# Altium schematic sheet [03] - 28 PINS SCHEMATIC.SchDoc (part 2 of 3)
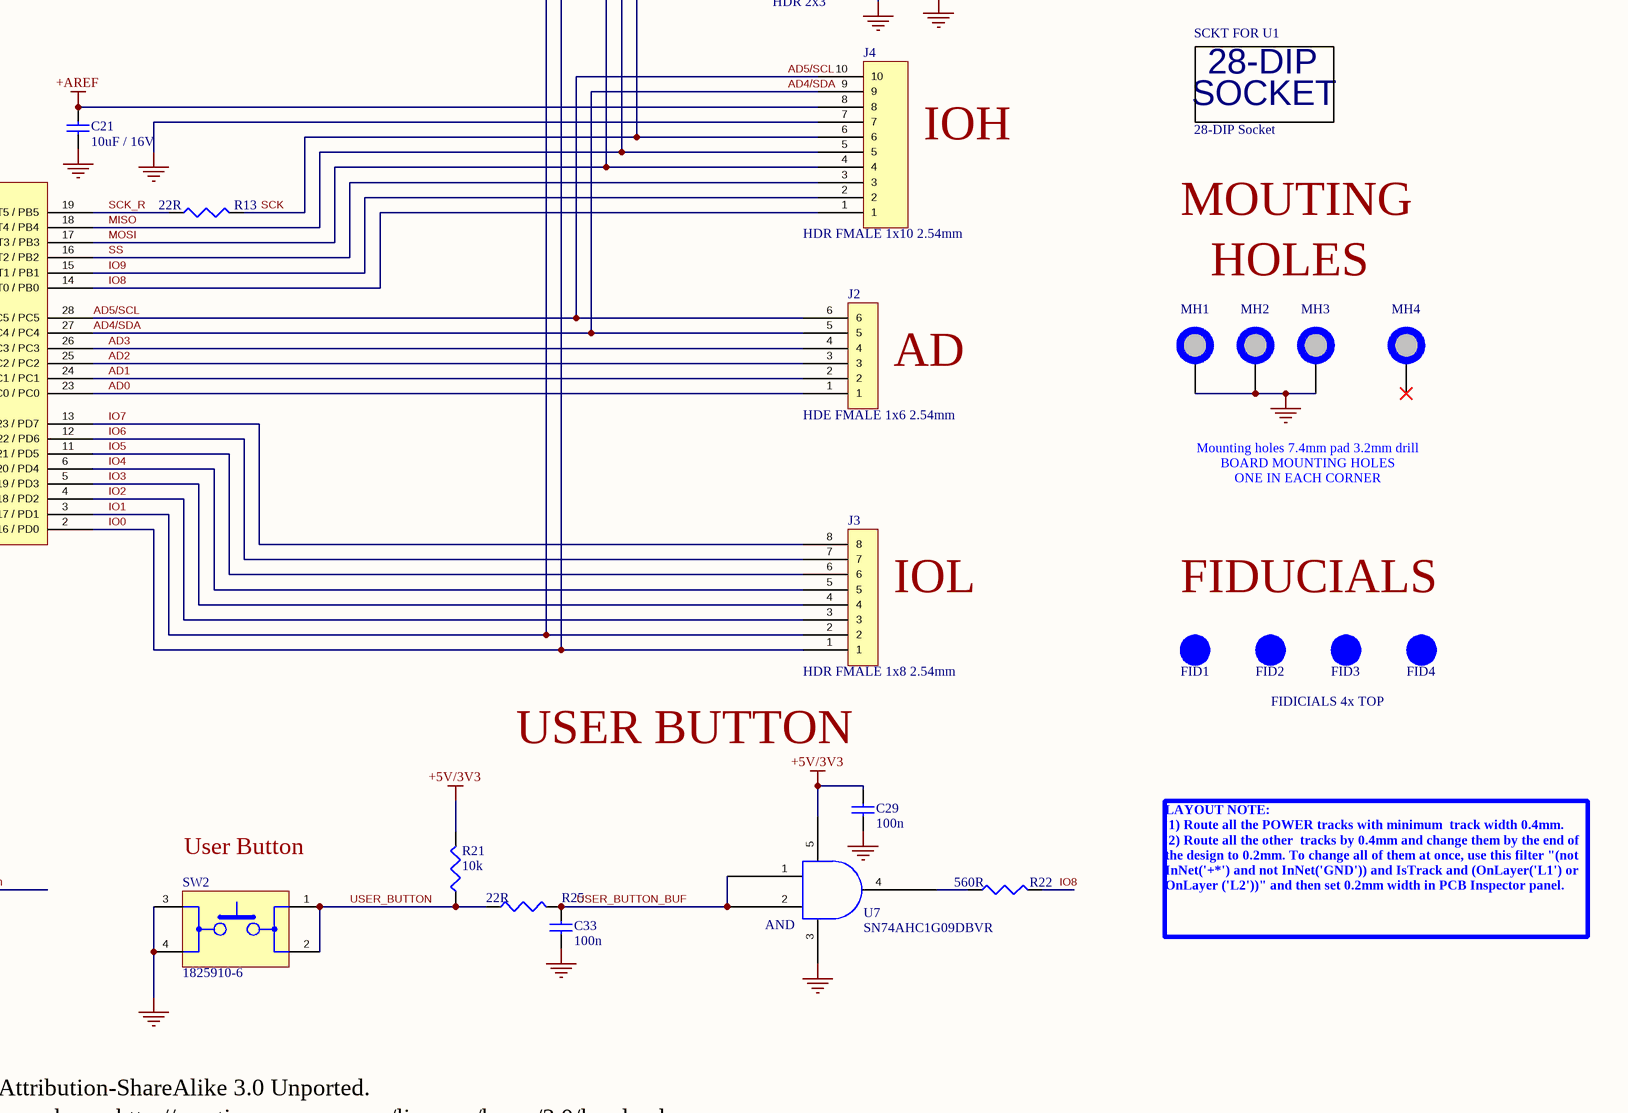
[diagram p4: [03] - 28 PINS SCHEMATIC.SchDoc, bottom right]
## Library data of the parts
C1 C2 = EEE-1AA101WR: Cap Aluminum Lytic 100uF 10V 20% (5 X 5.4mm) SMD 50mA 1000h 85C Automotive T/R; Manufacturer: Panasonic; Life (Hours): 1000Hour; Supplier 1: Digi-Key; Manufacturer Part Number: EEE-1AA101WR; Stock 1: 0; Pricing 1: 1=0.33, 10=0.232, 100=0.1395, 500=0.10462 (USD); Mount: Surface Mount,PCB; Case/Package: Radial; Contact Plating: Tin; Min Operating Temperature: -40°C; Max Operating Temperature: 85°C; Capacitance: 100uF; Tolerance: 20%; Ripple Current: 50mA; Voltage Rating: 10V; Packaging: Tape and Reel; Package Quantity: 1; Voltage Rating (DC): 10V; Termination: SMD/SMT; Ripple Current (AC): 50mA; Diameter: 5mm; Length: 5.5mm; Height: 5.4mm; Height - Seated (Max): 0.213inch; Radiation Hardening: No; Lead Free: Lead Free; REACH SVHC: Unknown; ComponentLink1URL: https://datasheet.ciiva.com/2983/aba0000ce2-2983906.pdf; ComponentLink1Description: https://datasheet.ciiva.com/2983/aba0000ce2-2983906.pdf; ComponentLink2URL: https://datasheet.ciiva.com/24027/aba0000ce2-40801-24027541.pdf; ComponentLink2Description: https://datasheet.ciiva.com/24027/aba0000ce2-40801-24027541.pdf; ComponentLink3URL: https://datasheet.ciiva.com/30075/11aba0000ce2-30075303.pdf; ComponentLink3Description: https://datasheet.ciiva.com/30075/11aba0000ce2-30075303.pdf; ComponentLink4URL: https://datasheet.ciiva.com/16427/aba0000ce2-16427544.pdf; ComponentLink4Description: https://datasheet.ciiva.com/16427/aba0000ce2-16427544.pdf; ComponentLink5URL: https://datasheet.ciiva.com/14598/70255710-14598233.pdf; ComponentLink5Description: https://datasheet.ciiva.com/14598/70255710-14598233.pdf; ComponentLink6URL: https://datasheet.ciiva.com/14605/70255710-14605689.pdf; ComponentLink6Description: https://datasheet.ciiva.com/14605/70255710-14605689.pdf; ComponentLink7URL: https://datasheet.ciiva.com/11673/aba0000ce2-11673882.pdf; ComponentLink7Description: https://datasheet.ciiva.com/11673/aba0000ce2-11673882.pdf; ComponentLink8URL: https://datasheet.ciiva.com/26945/getdatasheetpartid-169213-26945071.pdf; ComponentLink8Description: https://datasheet.ciiva.com/26945/getdatasheetpartid-169213-26945071.pdf; Supplier Part Number 1: PCE3867CT-ND
C3 C12 C13 C19 C21 C22 C34 = C2012X5R1C106M125AC: CAP CER 10UF 16V X5R 0805; Manufacturer: TDK; Dielectric Material: Ceramic; Tolerance: 20%; Supplier 1: Digi-Key; Manufacturer Part Number: C2012X5R1C106M125AC; Stock 1: 0; Pricing 1: 1=0.33, 10=0.272, 100=0.136, 250=0.102, 500=0.0901, 1000=0.0799 (USD); Mount: Surface Mount; Case/Package: 0805; Number of Pins: 2; Weight: 0.000194oz; Case Code (Metric): 2012; Case Code (Imperial): 0805; Min Operating Temperature: -55°C; Max Operating Temperature: 85°C; Capacitance: 10uF; Voltage Rating: 16V; Packaging: Tape and Reel; Voltage Rating (DC): 16V; Dielectric: X5R; Termination: SMD/SMT; Package Quantity: 1; Composition: Ceramic; Length: 2mm; Height: 1.25mm; Width: 0.049inch; Depth: 1.25mm; Thickness: 0.057inch; REACH SVHC: No SVHC; Lead Free: Lead Free; ComponentLink1URL: https://datasheet.ciiva.com/6289/tdkmlcccaprange-6289238.pdf; ComponentLink1Description: https://datasheet.ciiva.com/6289/tdkmlcccaprange-6289238.pdf; ComponentLink2URL: https://datasheet.ciiva.com/22725/1913358-22725558.pdf; ComponentLink2Description: https://datasheet.ciiva.com/22725/1913358-22725558.pdf; ComponentLink3URL: https://datasheet.ciiva.com/6252/tdkmlcccaprange-6252105.pdf; ComponentLink3Description: https://datasheet.ciiva.com/6252/tdkmlcccaprange-6252105.pdf; ComponentLink4URL: https://datasheet.ciiva.com/6252/tdkmlcccaprange-6252108.pdf; ComponentLink4Description: https://datasheet.ciiva.com/6252/tdkmlcccaprange-6252108.pdf; ComponentLink5URL: https://datasheet.ciiva.com/24218/c2012x5r1c106m125ac-264806-24218892.pdf; ComponentLink5Description: https://datasheet.ciiva.com/24218/c2012x5r1c106m125ac-264806-24218892.pdf; ComponentLink6URL: https://datasheet.ciiva.com/23803/1796654-23803022.pdf; ComponentLink6Description: https://datasheet.ciiva.com/23803/1796654-23803022.pdf; Supplier Part Number 1: 445-4115-1-ND
C4-C6 C8 C11 C14-C17 C20 C23 C24 C26 C28-C33 = C2012X7R1H104K085AA: CAP CER 0.1UF 50V X7R 0805; Manufacturer: TDK; Dielectric Material: Ceramic; Capacitance: 100nF; Tolerance: 10%; Supplier 1: Digi-Key; Manufacturer Part Number: C2012X7R1H104K085AA; Stock 1: 0; Pricing 1: 1=0.13, 10=0.093, 100=0.0438, 500=0.0307, 1000=0.02541 (USD); Mount: Surface Mount; Case/Package: 0805; Number of Pins: 2; Weight: 0.000194oz; Case Code (Metric): 2012; Case Code (Imperial): 0805; Min Operating Temperature: -55°C; Max Operating Temperature: 125°C; Dielectric: X7R; Voltage Rating: 50V; Packaging: Tape and Reel; Voltage Rating (DC): 50V; Termination: SMD/SMT; Package Quantity: 1; Composition: Ceramic; Voltage: 50V; Length: 2mm; Height: 0.85mm; Depth: 1.25mm; Width: 0.049inch; Thickness: 0.037inch; Radiation Hardening: No; REACH SVHC: No SVHC; Lead Free: Lead Free; ComponentLink1URL: https://datasheet.ciiva.com/11788/0900766b80c1bb00-11788128.pdf; ComponentLink1Description: https://datasheet.ciiva.com/11788/0900766b80c1bb00-11788128.pdf; ComponentLink2URL: https://datasheet.ciiva.com/6250/tdkmlcccaprange-6250821.pdf; ComponentLink2Description: https://datasheet.ciiva.com/6250/tdkmlcccaprange-6250821.pdf; ComponentLink3URL: https://datasheet.ciiva.com/24217/c2012x7r1h104k085aa-264864-24217862.pdf; ComponentLink3Description: https://datasheet.ciiva.com/24217/c2012x7r1h104k085aa-264864-24217862.pdf; ComponentLink4URL: https://datasheet.ciiva.com/24191/e412-c-24191447.pdf; ComponentLink4Description: https://datasheet.ciiva.com/24191/e412-c-24191447.pdf; ComponentLink5URL: https://datasheet.ciiva.com/6250/tdkmlcccaprange-6250824.pdf; ComponentLink5Description: https://datasheet.ciiva.com/6250/tdkmlcccaprange-6250824.pdf; ComponentLink6URL: https://datasheet.ciiva.com/23803/1796654-23803035.pdf; ComponentLink6Description: https://datasheet.ciiva.com/23803/1796654-23803035.pdf; ComponentLink7URL: https://datasheet.ciiva.com/28602/1571323-28602204.pdf; ComponentLink7Description: https://datasheet.ciiva.com/28602/1571323-28602204.pdf; Supplier Part Number 1: 445-7534-1-ND
C7 = C2012X5R1E105K125AA: CAP CER 1UF 25V X5R 0805; Manufacturer: TDK; Dielectric Material: Ceramic; Tolerance: 10%; Supplier 1: Digi-Key; Manufacturer Part Number: C2012X5R1E105K125AA; Stock 1: 20000; Pricing 1: 1=0.21, 10=0.146, 100=0.0688, 500=0.04822, 1000=0.03993 (USD); Mount: Surface Mount; Case/Package: 0805; Number of Pins: 2; Weight: 0.000194oz; Case Code (Metric): 2012; Case Code (Imperial): 0805; Min Operating Temperature: -55°C; Max Operating Temperature: 85°C; Capacitance: 1uF; Voltage Rating: 25V; Packaging: Tape and Reel; Voltage Rating (DC): 25V; Dielectric: X5R; Termination: SMD/SMT; Package Quantity: 2000; Composition: Ceramic; Voltage: 25V; Length: 2mm; Height: 1.25mm; Depth: 1.25mm; Width: 0.049inch; Thickness: 0.057inch; Radiation Hardening: No; Lead Free: Lead Free; REACH SVHC: No SVHC; ComponentLink1URL: https://datasheet.ciiva.com/11787/0900766b80c1bb00-11787608.pdf; ComponentLink1Description: https://datasheet.ciiva.com/11787/0900766b80c1bb00-11787608.pdf; ComponentLink2URL: https://datasheet.ciiva.com/24218/c2012x5r1e105k125aa-264807-24218920.pdf; ComponentLink2Description: https://datasheet.ciiva.com/24218/c2012x5r1e105k125aa-264807-24218920.pdf; ComponentLink3URL: https://datasheet.ciiva.com/16449/e412-c-16449595.pdf; ComponentLink3Description: https://datasheet.ciiva.com/16449/e412-c-16449595.pdf; ComponentLink4URL: https://datasheet.ciiva.com/28602/1744655-28602171.pdf; ComponentLink4Description: https://datasheet.ciiva.com/28602/1744655-28602171.pdf; ComponentLink5URL: https://datasheet.ciiva.com/15192/getdatasheetpartid-726707-15192140.pdf; ComponentLink5Description: https://datasheet.ciiva.com/15192/getdatasheetpartid-726707-15192140.pdf; Supplier Part Number 1: 445-1419-1-ND
C9 C10 C25 C27 = C0805C180J5GAC-TU: CAP CER 18PF 50V NP0 0805; Manufacturer: KEMET; Dielectric Material: Ceramic; Tolerance: 5%; Dielectric: C0G; Temperature Coefficient: 30ppm/°C; Dissipation Factor: 0.1%; Supplier 1: Digi-Key; Manufacturer Part Number: C0805C180J5GAC-TU; Stock 1: 25150; Pricing 1: 1=0.13, 10=0.09, 100=0.0425, 500=0.02982, 1000=0.02468 (USD); Mount: Surface Mount,PCB; Case/Package: 0805; Number of Pins: 2; Case Code (Metric): 2012; Case Code (Imperial): 0805; Contact Material: Tin; Min Operating Temperature: -55°C; Max Operating Temperature: 125°C; Voltage Rating (DC): 50V; Packaging: Tape and Reel; Capacitance: 18pF; Termination: SMD/SMT; Voltage: 50V; Voltage Rating: 50V; Package Quantity: 1; Length: 2mm; Height: 0.78mm; Depth: 1.25mm; Width: 0.049inch; Thickness: 0.035inch; Lead Pitch: 0.75mm; Radiation Hardening: No; Lead Free: Lead Free; REACH SVHC: No SVHC; ComponentLink1URL: https://datasheet.ciiva.com/6136/1725432-6136736.pdf; ComponentLink1Description: https://datasheet.ciiva.com/6136/1725432-6136736.pdf; ComponentLink2URL: https://datasheet.ciiva.com/144/docfinderpartnumber-c0805c180j5gactu-144929.pdf; ComponentLink2Description: https://datasheet.ciiva.com/144/docfinderpartnumber-c0805c180j5gactu-144929.pdf; ComponentLink3URL: https://datasheet.ciiva.com/22746/1769375-22746770.pdf; ComponentLink3Description: https://datasheet.ciiva.com/22746/1769375-22746770.pdf; ComponentLink4URL: https://datasheet.ciiva.com/28696/1789732-28696024.pdf; ComponentLink4Description: https://datasheet.ciiva.com/28696/1789732-28696024.pdf; ComponentLink5URL: https://datasheet.ciiva.com/7842/1725432-7842235.pdf; ComponentLink5Description: https://datasheet.ciiva.com/7842/1725432-7842235.pdf; ComponentLink6URL: https://datasheet.ciiva.com/11463/kem-c1003-c0g-smd-11463499.pdf; ComponentLink6Description: https://datasheet.ciiva.com/11463/kem-c1003-c0g-smd-11463499.pdf; ComponentLink7URL: https://datasheet.ciiva.com/7842/1725432-7842236.pdf; ComponentLink7Description: https://datasheet.ciiva.com/7842/1725432-7842236.pdf; ComponentLink8URL: https://datasheet.ciiva.com/26923/getdatasheetpartid-759702-26923980.pdf; ComponentLink8Description: https://datasheet.ciiva.com/26923/getdatasheetpartid-759702-26923980.pdf; ComponentLink9URL: https://datasheet.ciiva.com/5419/kem-c1003-c0g-smd-356956-5419246.pdf; ComponentLink9Description: https://datasheet.ciiva.com/5419/kem-c1003-c0g-smd-356956-5419246.pdf; Supplier Part Number 1: 399-1112-1-ND
D1 = LGL29K-G2J1-24-Z: LED GREEN DIFFUSED 0603 SMD; Manufacturer: Osram Opto; Forward Current: 20mA; Forward Voltage: 1.7V; Luminous Intensity: 3.92mcd; Viewing Angle: 160°; Lens Style: Diffused,Colorless,Rectangular; Test Current: 2mA; Dominant Wavelength: 570nm; Luminous Flux: 0.012lm; Number of LEDs: 1; Supplier 1: Digi-Key; Manufacturer Part Number: LGL29K-G2J1-24-Z; Stock 1: 606973; Pricing 1: 1=0.56, 10=0.403, 25=0.3292, 100=0.2633, 250=0.2222, 500=0.18926, 1000=0.14812, 2500=0.13578 (USD); Mount: Surface Mount; Case/Package: 0603; Number of Pins: 2; Colour: Green; Case Code (Metric): 1608; Case Code (Imperial): 0603; Min Operating Temperature: -40°C; Max Operating Temperature: 100°C; Illumination Colour: Green; Packaging: Tape and Reel; Package Quantity: 5000; Length: 1.7mm; Height: 0.65mm; Width: 0.8mm; Radiation Hardening: No; ComponentLink1URL: https://datasheet.ciiva.com/4689/g-l29k-39844-4689584.pdf; ComponentLink1Description: https://datasheet.ciiva.com/4689/g-l29k-39844-4689584.pdf; ComponentLink2URL: https://datasheet.ciiva.com/2112/00077107-0-2112886.pdf; ComponentLink2Description: https://datasheet.ciiva.com/2112/00077107-0-2112886.pdf; ComponentLink3URL: https://datasheet.ciiva.com/2112/00077107-0-2112887.pdf; ComponentLink3Description: https://datasheet.ciiva.com/2112/00077107-0-2112887.pdf; ComponentLink4URL: https://datasheet.ciiva.com/2112/00077107-0-2112888.pdf; ComponentLink4Description: https://datasheet.ciiva.com/2112/00077107-0-2112888.pdf; Supplier Part Number 1: 475-2709-1-ND
D2-D4 = LOL29K-H2K1-24-Z: LED ORANGE DIFFUSED 0603 SMD; Manufacturer: Osram Opto; Forward Current: 20mA; Forward Voltage: 1.8V; Luminous Intensity: 6.3mcd; Viewing Angle: 160°; Lens Style: Diffused,Colorless,Rectangular; Test Current: 2mA; Dominant Wavelength: 606nm; Luminous Flux: 0.025lm; Number of LEDs: 1; Supplier 1: Digi-Key; Manufacturer Part Number: LOL29K-H2K1-24-Z; Stock 1: 11142; Pricing 1: 1=0.49, 10=0.35, 25=0.286, 100=0.2287, 250=0.193, 500=0.1644, 1000=0.12866, 2500=0.11794 (USD); Mount: Surface Mount; Case/Package: 0603; Number of Pins: 2; Colour: Orange; Case Code (Metric): 1608; Case Code (Imperial): 0603; Min Operating Temperature: -40°C; Max Operating Temperature: 100°C; Illumination Colour: Orange; Packaging: Tape and Reel; Package Quantity: 5000; Length: 1.7mm; Height: 0.65mm; Width: 0.8mm; ComponentLink1URL: https://datasheet.ciiva.com/2112/00077105-0-2112904.pdf; ComponentLink1Description: https://datasheet.ciiva.com/2112/00077105-0-2112904.pdf; ComponentLink2URL: https://datasheet.ciiva.com/2112/00077105-0-2112905.pdf; ComponentLink2Description: https://datasheet.ciiva.com/2112/00077105-0-2112905.pdf; ComponentLink3URL: https://datasheet.ciiva.com/2112/00077105-0-2112906.pdf; ComponentLink3Description: https://datasheet.ciiva.com/2112/00077105-0-2112906.pdf; Supplier Part Number 1: 475-2740-1-ND
D5 D6 = BAT54HT1G: DIODE SCHOTTKY 30V 200MA SOD323; Manufacturer: ON Semiconductor / Fairchild; Forward Voltage: 800mV; Recovery Time: 5ns; Peak Non-Repetitive Surge Current: 600mA; Element Configuration: Single; Peak Reverse Current: 2uA; Power Dissipation: 200mW; Polarity: Standard; Capacitance: 10pF; Supplier 1: Digi-Key; Manufacturer Part Number: BAT54HT1G; Stock 1: 201212; Pricing 1: 1=0.28, 10=0.225, 100=0.1195, 500=0.07862, 1000=0.05346 (USD); Mount: Surface Mount; Number of Pins: 2; Contact Plating: Tin,Matte; Min Operating Temperature: -55°C; Max Operating Temperature: 150°C; Packaging: Tape and Reel; Forward Current: 200mA; Package Quantity: 3000; Average Rectified Current: 200mA; Reverse Recovery Time: 5ns; Max Repetitive Reverse Voltage (Vrrm): 30V; Max Forward Surge Current (Ifsm): 600mA; Max Reverse Voltage (DC): 30V; Max Surge Current: 600mA; Voltage Rating (DC): 30V; Current Rating: 200mA; Output Current: 200mA; Reverse Voltage: 30V; Max Reverse Leakage Current: 2uA; Length: 1.8mm; Height: 1mm; Width: 1.35mm; Radiation Hardening: No; Lead Free: Lead Free; REACH SVHC: No SVHC; ComponentLink1URL: https://datasheet.ciiva.com/8303/bat54ht1g-8303712.pdf; ComponentLink1Description: https://datasheet.ciiva.com/8303/bat54ht1g-8303712.pdf; ComponentLink2URL: https://datasheet.ciiva.com/1180/bat54ht1-d-1180252.pdf; ComponentLink2Description: https://datasheet.ciiva.com/1180/bat54ht1-d-1180252.pdf; ComponentLink3URL: https://datasheet.ciiva.com/1180/bat54ht1-d-1180251.pdf; ComponentLink3Description: https://datasheet.ciiva.com/1180/bat54ht1-d-1180251.pdf; ComponentLink4URL: https://datasheet.ciiva.com/34301/806549-34301562.pdf; ComponentLink4Description: https://datasheet.ciiva.com/34301/806549-34301562.pdf; ComponentLink5URL: https://datasheet.ciiva.com/1240/1747983-1240762.pdf; ComponentLink5Description: https://datasheet.ciiva.com/1240/1747983-1240762.pdf; ComponentLink6URL: https://datasheet.ciiva.com/4452/bat54ht1g-104602-4452889.pdf; ComponentLink6Description: https://datasheet.ciiva.com/4452/bat54ht1g-104602-4452889.pdf; ComponentLink7URL: https://datasheet.ciiva.com/46429/1727620-46429206.pdf; ComponentLink7Description: https://datasheet.ciiva.com/46429/1727620-46429206.pdf; ComponentLink8URL: https://datasheet.ciiva.com/8303/bat54ht1g-8303645.pdf; ComponentLink8Description: https://datasheet.ciiva.com/8303/bat54ht1g-8303645.pdf; ComponentLink9URL: https://datasheet.ciiva.com/8294/bat54ht1-d-8294645.pdf; ComponentLink9Description: https://datasheet.ciiva.com/8294/bat54ht1-d-8294645.pdf; ComponentLink10URL: https://datasheet.ciiva.com/915/bat54ht1-d-915444.pdf; ComponentLink10Description: https://datasheet.ciiva.com/915/bat54ht1-d-915444.pdf; ComponentLink11URL: https://datasheet.ciiva.com/915/bat54ht1-d-915443.pdf; ComponentLink11Description: https://datasheet.ciiva.com/915/bat54ht1-d-915443.pdf; ComponentLink12URL: https://datasheet.ciiva.com/910/bat54ht1g-910499.pdf; ComponentLink12Description: https://datasheet.ciiva.com/910/bat54ht1g-910499.pdf; ComponentLink13URL: https://datasheet.ciiva.com/30479/0900766b811a63a9-30479442.pdf; ComponentLink13Description: https://datasheet.ciiva.com/30479/0900766b811a63a9-30479442.pdf; ComponentLink14URL: https://datasheet.ciiva.com/4714/bat54ht1-d-72881-4714706.pdf; ComponentLink14Description: https://datasheet.ciiva.com/4714/bat54ht1-d-72881-4714706.pdf; ComponentLink15URL: https://datasheet.ciiva.com/910/bat54ht1g-910498.pdf; ComponentLink15Description: https://datasheet.ciiva.com/910/bat54ht1g-910498.pdf; ComponentLink16URL: https://datasheet.ciiva.com/910/bat54ht1g-910497.pdf; ComponentLink16Description: https://datasheet.ciiva.com/910/bat54ht1g-910497.pdf; ComponentLink17URL: https://datasheet.ciiva.com/915/bat54ht1-d-915445.pdf; ComponentLink17Description: https://datasheet.ciiva.com/915/bat54ht1-d-915445.pdf; ComponentLink18URL: https://datasheet.ciiva.com/17020/bat54ht1g-17020445.pdf; ComponentLink18Description: https://datasheet.ciiva.com/17020/bat54ht1g-17020445.pdf; ComponentLink19URL: https://datasheet.ciiva.com/48686/001262925-da-01-en-diode-schottky-30v-bat54ht1g-sod-323-fsc-48686266.pdf; ComponentLink19Description: https://datasheet.ciiva.com/48686/001262925-da-01-en-diode-schottky-30v-bat54ht1g-sod-323-fsc-48686266.pdf; Supplier Part Number 1: BAT54HT1GOSCT-ND
FB1-FB3 = MPZ2012S601AT000: TDK   MPZ2012S601AT000   FERRITE BEAD, 0.1OHM, 2A, 0805, FULL REEL; Impedance: 600R; DC Resistance (DCR): 100mR; Supplier 1: Digi-Key; Manufacturer: TDK; Manufacturer Part Number: MPZ2012S601AT000; Stock 1: 390926; Pricing 1: 1=0.11, 10=0.091, 25=0.0704, 50=0.0584, 100=0.0503, 250=0.04028, 500=0.03624, 1000=0.0302 (USD); Mount: Surface Mount; Case/Package: 0805; Case Code (Metric): 2012; Case Code (Imperial): 0805; Packaging: Tape and Reel; Package Quantity: 1; Current Rating: 2A; Max DC Current: 2A; Length: 0.079inch; Height: 0.041inch; Width: 0.049inch; REACH SVHC: No SVHC; Lead Free: Lead Free; ComponentLink1URL: https://datasheet.ciiva.com/46634/beads-commercial-power-mpz-en-46634377.pdf; ComponentLink1Description: https://datasheet.ciiva.com/46634/beads-commercial-power-mpz-en-46634377.pdf; ComponentLink2URL: https://datasheet.ciiva.com/46381/1750041-46381645.pdf; ComponentLink2Description: https://datasheet.ciiva.com/46381/1750041-46381645.pdf; ComponentLink3URL: https://datasheet.ciiva.com/46634/beads-commercial-power-mpz-en-46634606.pdf; ComponentLink3Description: https://datasheet.ciiva.com/46634/beads-commercial-power-mpz-en-46634606.pdf; ComponentLink4URL: https://datasheet.ciiva.com/46634/beads-commercial-power-mpz-en-46634335.pdf; ComponentLink4Description: https://datasheet.ciiva.com/46634/beads-commercial-power-mpz-en-46634335.pdf; Supplier Part Number 1: 445-2206-1-ND
FID1-FID4 = FID_1MMC: Fiducial 40mil Diameter, 20mil Mask
J1 J3 = M20-7820842: Headers & Wire Housings 8 PIN SIL VERTICAL SOCKET GOLD+TIN; Manufacturer: Harwin; Number of Contacts: 8; Max Current Rating: 3A; Contact Resistance: 20mR; Connector Type: Receptacle,Socket; Gender: Female; Supplier 1: Digi-Key; Manufacturer Part Number: M20-7820842; Stock 1: 1809; Pricing 1: 1=1.1, 10=0.972, 100=0.8382, 500=0.6858, 1000=0.6096, 5000=0.5334, 10000=0.50673 (USD); Mount: Through Hole; Case/Package: SIL; Weight: 0.025397oz; Contact Plating: Tin,Gold; Colour: Black; Contact Material: Bronze; Housing Colour: Black; Housing Material: Polyamide; Min Operating Temperature: -40°C; Max Operating Temperature: 105°C; Number of Rows: 1; Termination: Solder; Contact Gender: Female; Package Quantity: 29; Packaging: Rail/Tube; Number of Positions: 8; Orientation: Straight; Length: 20.72mm; Pitch: 2.54mm; Depth: 2.5mm; Radiation Hardening: No; ComponentLink1URL: https://datasheet.ciiva.com/16732/m20-782-16732663.pdf; ComponentLink1Description: https://datasheet.ciiva.com/16732/m20-782-16732663.pdf; ComponentLink2URL: https://datasheet.ciiva.com/9480/m20-782-9480074.pdf; ComponentLink2Description: https://datasheet.ciiva.com/9480/m20-782-9480074.pdf; Supplier Part Number 1: 952-1823-ND
J2 = M20-7820646: Headers & Wire Housings 6 PIN SIL VERTICAL SOCKET TIN; Manufacturer: Harwin; Number of Contacts: 6; Max Current Rating: 3A; Contact Resistance: 20mR; Connector Type: Receptacle,Socket; Gender: Female; Supplier 1: Digi-Key; Manufacturer Part Number: M20-7820646; Stock 1: 3671; Pricing 1: 1=0.96, 10=0.842, 100=0.726, 500=0.594, 1000=0.528, 5000=0.462, 10000=0.4389 (USD); Mount: Through Hole; Case/Package: SIL; Colour: Black; Contact Plating: Tin; Contact Material: Bronze; Housing Colour: Black; Housing Material: Nylon; Min Operating Temperature: -40°C; Max Operating Temperature: 105°C; Number of Rows: 1; Termination: Solder; Packaging: Rail/Tube; Contact Gender: Female; Package Quantity: 38; Number of Positions: 6; Orientation: Straight; Length: 15.64mm; Pitch: 2.54mm; Depth: 2.5mm; Radiation Hardening: No; ComponentLink1URL: http://www.harwin.com/include/downloads/pdfs/2010PAGE120.PDF; ComponentLink1Description: http://www.harwin.com/include/downloads/pdfs/2010PAGE120.PDF; ComponentLink2URL: https://cdn.harwin.com/pdfs/Harwin_PC_Connectors_M20.pdf; ComponentLink2Description: https://cdn.harwin.com/pdfs/Harwin_PC_Connectors_M20.pdf; ComponentLink3URL: http://components.arrow.com/part/dataview/0323_00725884; ComponentLink3Description: http://components.arrow.com/part/dataview/0323_00725884; Supplier Part Number 1: 952-1809-ND
J4 = M20-7821046: Headers & Wire Housings 10 PIN SIL VERTICAL SOCKET TIN; Manufacturer: Harwin; Number of Contacts: 10; Max Current Rating: 3A; Contact Resistance: 20mR; Mating Cycles: 50; Connector Type: Receptacle,Socket; Gender: Receptacle; Insulation Resistance: 1MR; Hole Diameter: 0.8mm; Supplier 1: Digi-Key; Manufacturer Part Number: M20-7821046; Stock 1: 339; Pricing 1: 1=1.28, 10=1.122, 100=0.968, 500=0.792, 1000=0.704, 5000=0.616, 10000=0.5852 (USD); Mount: Through Hole; Case/Package: SIL; Colour: Black; Contact Plating: Tin; Contact Material: Bronze; Housing Colour: Black; Housing Material: Polyamide; Min Operating Temperature: -40°C; Max Operating Temperature: 105°C; Number of Rows: 1; Termination: Solder; Packaging: Rail/Tube; Contact Gender: Female; Package Quantity: 23; Current Rating: 3A; Number of Positions: 10; Orientation: Straight; Length: 25.8mm; Pitch: 2.54mm; Lead Pitch: 2.54mm; Depth: 2.5mm; Radiation Hardening: No; REACH SVHC: No SVHC; ComponentLink1URL: https://datasheet.ciiva.com/26899/getdatasheetpartid-559226-26899379.pdf; ComponentLink1Description: https://datasheet.ciiva.com/26899/getdatasheetpartid-559226-26899379.pdf; ComponentLink2URL: https://datasheet.ciiva.com/6785/m20-782-6785605.pdf; ComponentLink2Description: https://datasheet.ciiva.com/6785/m20-782-6785605.pdf; ComponentLink3URL: https://datasheet.ciiva.com/10151/m20-782-10151366.pdf; ComponentLink3Description: https://datasheet.ciiva.com/10151/m20-782-10151366.pdf; ComponentLink4URL: https://datasheet.ciiva.com/16732/m20-782-16732152.pdf; ComponentLink4Description: https://datasheet.ciiva.com/16732/m20-782-16732152.pdf; ComponentLink5URL: https://datasheet.ciiva.com/11753/0900766b80dc1d2b-11753869.pdf; ComponentLink5Description: https://datasheet.ciiva.com/11753/0900766b80dc1d2b-11753869.pdf; Supplier Part Number 1: 952-1847-ND
J5 J6 = 67997-106HLF: 6 Positions Header, Unshrouded Connector 0.100" (2.54mm) Through Hole Gold or Gold, GXT™; Manufacturer: Amphenol FCI; Number of Contacts: 6; Current Rating: 3A; Voltage Rating: 1.5kV; Insulation Resistance: 5GR; Gender: Male; Connector Type: Male Pin; Row Spacing: 0.1inch; Mating Post Length: 5.84mm; Supplier 1: Digi-Key; Manufacturer Part Number: 67997-106HLF; Stock 1: 1291; Pricing 1: 1=1.73, 10=1.568, 100=1.3436, 500=1.11966, 1000=0.9597, 5000=0.85093, 10000=0.83174 (USD); Mount: Through Hole; Contact Plating: Gold,GXT; Contact Material: Bronze; Colour: Black; Housing Colour: Black; Housing Material: Thermoplastic; Min Operating Temperature: -65°C; Max Operating Temperature: 125°C; Number of Rows: 2; Termination: Through Hole; Packaging: Bulk; Package Quantity: 100; Contact Gender: Male; Number of Positions: 6; Max Voltage Rating (AC): 1.5kV; Orientation: Straight; Length: 7.62mm; Pitch: 2.54mm; Contact Mating Length: 0.23inch; Termination Post Length: 3.05mm; Depth: 4.83mm; Radiation Hardening: No; REACH SVHC: No SVHC; Lead Free: Lead Free; Flammability Rating: UL94 V-0; ComponentLink1URL: https://datasheet.ciiva.com/10149/67996-10149221.pdf; ComponentLink1Description: https://datasheet.ciiva.com/10149/67996-10149221.pdf; ComponentLink2URL: https://datasheet.ciiva.com/46393/1876884-46393067.pdf; ComponentLink2Description: https://datasheet.ciiva.com/46393/1876884-46393067.pdf; ComponentLink3URL: https://datasheet.ciiva.com/722/67996-722044.pdf; ComponentLink3Description: https://datasheet.ciiva.com/722/67996-722044.pdf; ComponentLink4URL: https://datasheet.ciiva.com/5153/67996-222463-5153820.pdf; ComponentLink4Description: https://datasheet.ciiva.com/5153/67996-222463-5153820.pdf; ComponentLink5URL: https://datasheet.ciiva.com/16726/67996-16726286.pdf; ComponentLink5Description: https://datasheet.ciiva.com/16726/67996-16726286.pdf; Supplier Part Number 1: 609-3393-ND
J7 = 10118193-0001LF: USB - micro B USB 2.0 Receptacle Connector 5 Position Surface Mount, Right Angle, Horizontal; Manufacturer: Amphenol FCI; Gender: Female; Connector Type: USB,Receptacle; Number of Contacts: 5; Insulation Resistance: 1GR; Number of Ports: 1; Current Rating: 1.8A; Max Voltage Rating (AC): 100V; Pitch: 0.65mm; Supplier 1: Digi-Key; Manufacturer Part Number: 10118193-0001LF; Stock 1: 169486; Pricing 1: 1=0.5, 10=0.464, 25=0.418, 50=0.3716, 100=0.3561, 250=0.32516, 500=0.30966 (USD); Mount: Surface Mount,Horizontal; Contact Material: Copper Alloy; Contact Plating: Gold; Colour: Black; Number of Terminals: 5; Housing Material: Polymer; Min Operating Temperature: -55°C; Max Operating Temperature: 85°C; Termination: Solder; Orientation: Right Angle; Package Quantity: 1200; Packaging: Tape and Reel; Voltage Rating: 100V; Features: Shielded; Length: 7.86mm; Depth: 5.67mm; Radiation Hardening: No; Flammability Rating: UL94 V-0; ComponentLink1URL: https://datasheet.ciiva.com/851/10118193-851106.pdf; ComponentLink1Description: https://datasheet.ciiva.com/851/10118193-851106.pdf; ComponentLink2URL: https://datasheet.ciiva.com/14802/10118193-0001lf-webpage-14802386.pdf; ComponentLink2Description: https://datasheet.ciiva.com/14802/10118193-0001lf-webpage-14802386.pdf; ComponentLink3URL: https://datasheet.ciiva.com/851/10118193-851107.pdf; ComponentLink3Description: https://datasheet.ciiva.com/851/10118193-851107.pdf; ComponentLink4URL: https://datasheet.ciiva.com/851/10118193-851108.pdf; ComponentLink4Description: https://datasheet.ciiva.com/851/10118193-851108.pdf; ComponentLink5URL: https://datasheet.ciiva.com/26853/getdatasheetpartid-418618-26853893.pdf; ComponentLink5Description: https://datasheet.ciiva.com/26853/getdatasheetpartid-418618-26853893.pdf; ComponentLink6URL: https://datasheet.ciiva.com/14618/70236827-14618887.pdf; ComponentLink6Description: https://datasheet.ciiva.com/14618/70236827-14618887.pdf; ComponentLink7URL: https://datasheet.ciiva.com/4598/10118193ac-197151-4598799.pdf; ComponentLink7Description: https://datasheet.ciiva.com/4598/10118193ac-197151-4598799.pdf; Supplier Part Number 1: 609-4616-1-ND
J8 J9 = PAD_WITH_HOLE_4MMx1.5MM: Pad with a hole 4mmx1.5mm
JP1 JP4 = 68000-103HLF: 3 Positions Header, Unshrouded Connector 0.100" (2.54mm) Through Hole Gold or Gold, GXT™; Manufacturer: Amphenol FCI; Number of Contacts: 3; Current Rating: 3A; Voltage Rating: 1.5kV; Insulation Resistance: 5GR; Gender: Male; Connector Type: Male Pin; Mating Post Length: 5.84mm; Supplier 1: Digi-Key; Manufacturer Part Number: 68000-103HLF; Stock 1: 30284; Pricing 1: 1=0.29, 10=0.271, 100=0.1894, 500=0.16234, 1000=0.13528, 5000=0.11595, 10000=0.10822 (USD); Mount: Through Hole; Contact Plating: Gold,GXT; Contact Material: Bronze; Colour: Black; Housing Colour: Black; Housing Material: Thermoplastic; Min Operating Temperature: -65°C; Max Operating Temperature: 125°C; Number of Rows: 1; Termination: Solder; Contact Gender: Male; Package Quantity: 100; Packaging: Bulk; Number of Positions: 3; Max Voltage Rating (AC): 1.5kV; Orientation: Straight; Length: 7.62mm; Pitch: 2.54mm; Termination Post Length: 2.41mm; Contact Mating Length: 0.23inch; Depth: 2.41mm; Radiation Hardening: No; REACH SVHC: No SVHC; Flammability Rating: UL94 V-0; ComponentLink1URL: https://datasheet.ciiva.com/5157/68000-274283-5157301.pdf; ComponentLink1Description: https://datasheet.ciiva.com/5157/68000-274283-5157301.pdf; ComponentLink2URL: https://datasheet.ciiva.com/46392/1914865-46392021.pdf; ComponentLink2Description: https://datasheet.ciiva.com/46392/1914865-46392021.pdf; ComponentLink3URL: https://datasheet.ciiva.com/10149/68000-10149754.pdf; ComponentLink3Description: https://datasheet.ciiva.com/10149/68000-10149754.pdf; ComponentLink4URL: https://datasheet.ciiva.com/731/68000-731071.pdf; ComponentLink4Description: https://datasheet.ciiva.com/731/68000-731071.pdf; Supplier Part Number 1: 609-3461-ND
JP2 = 68602-204HLF: 4 Positions Header, Unshrouded Connector 0.100" (2.54mm) Through Hole Gold or Gold, GXT™; Manufacturer: Amphenol FCI; Current Rating: 3A; Voltage Rating: 1.5kV; Number of Positions: 4; Insulation Resistance: 5GR; Gender: Male; Connector Type: Male Pin; Row Spacing: 0.1inch; Mating Post Length: 5.84mm; Supplier 1: Digi-Key; Manufacturer Part Number: 68602-204HLF; Stock 1: 2349; Pricing 1: 1=0.33, 10=0.31, 100=0.2168, 500=0.18586, 1000=0.15488, 5000=0.13275, 10000=0.1239 (USD); Mount: Through Hole; Contact Plating: Gold,GXT; Colour: Black; Contact Material: Bronze; Housing Material: Thermoplastic; Min Operating Temperature: -65°C; Max Operating Temperature: 125°C; Packaging: Bulk; Number of Rows: 2; Package Quantity: 100; Contact Gender: Male; Termination: Solder; Number of Contacts: 4; Pitch: 2.54mm; Contact Mating Length: 0.23inch; Termination Post Length: 3.81mm; Radiation Hardening: No; Flammability Rating: UL94 V-0; ComponentLink1URL: https://datasheet.ciiva.com/728/67996-728884.pdf; ComponentLink1Description: https://datasheet.ciiva.com/728/67996-728884.pdf; Supplier Part Number 1: 609-3369-ND
JP3 = 68001-204HLF: 4 Positions Header, Unshrouded Connector 0.100" (2.54mm) Through Hole Gold or Gold, GXT™; Manufacturer: Amphenol FCI; Current Rating: 3A; Voltage Rating: 1.5kV; Number of Positions: 4; Insulation Resistance: 5GR; Gender: Male; Connector Type: Male Pin; Mating Post Length: 5.84mm; Supplier 1: Digi-Key; Manufacturer Part Number: 68001-204HLF; Stock 1: 4441; Pricing 1: 1=0.37, 10=0.347, 100=0.243, 500=0.20832, 1000=0.1736, 5000=0.1488, 10000=0.13888 (USD); Mount: Through Hole; Colour: Black; Contact Plating: Gold,GXT; Contact Material: Bronze; Housing Material: Thermoplastic; Min Operating Temperature: -65°C; Max Operating Temperature: 125°C; Package Quantity: 100; Number of Rows: 1; Packaging: Bulk; Contact Gender: Male; Termination: Solder; Number of Contacts: 4; Orientation: Straight; Pitch: 2.54mm; Contact Mating Length: 0.23inch; Termination Post Length: 3.05mm; Radiation Hardening: No; Flammability Rating: UL94 V-0; ComponentLink1URL: https://datasheet.ciiva.com/726/68000-726529.pdf; ComponentLink1Description: https://datasheet.ciiva.com/726/68000-726529.pdf; ComponentLink2URL: https://datasheet.ciiva.com/5164/68000-274255-5164127.pdf; ComponentLink2Description: https://datasheet.ciiva.com/5164/68000-274255-5164127.pdf; Supplier Part Number 1: 609-3402-ND
L1 = L1210R2R2MDWIT: Inductor Chip Wirewound 2.2uH 20% 100KHz 1.13A 80mOhm DCR 1210 T/R; Manufacturer: KEMET; Core Material: Ferrite; Shielding: Unshielded; Self Resonant Frequency: 190MHz; DC Resistance (DCR): 80mR; Supplier 1: Digi-Key; Manufacturer Part Number: L1210R2R2MDWIT; Stock 1: 6167; Pricing 1: 1=0.55, 10=0.479, 100=0.3421, 500=0.28738 (USD); Mount: Surface Mount; Case/Package: 1210; Case Code (Metric): 3225; Case Code (Imperial): 1210; Min Operating Temperature: -40°C; Max Operating Temperature: 105°C; Tolerance: 20%; Inductance: 2.2uh; Max DC Current: 2A; Package Quantity: 1000; Current Rating: 2A; Packaging: Tape and Reel; Inductance Tolerance: 20%; Composition: Wirewound,Ceramic; Test Frequency: 100kHz; Termination: SMD/SMT; DC Current: 1.13A; Military Standard: Not; Length: 0.126inch; Height: 2.5mm; Width: 0.098inch; Height - Seated (Max): 0.106inch; Depth: 2.7mm; Radiation Hardening: No; REACH SVHC: No SVHC; ComponentLink1URL: https://datasheet.ciiva.com/4957/f3115-4957838.pdf; ComponentLink1Description: https://datasheet.ciiva.com/4957/f3115-4957838.pdf; ComponentLink2URL: https://datasheet.ciiva.com/17280/f3115-17280270.pdf; ComponentLink2Description: https://datasheet.ciiva.com/17280/f3115-17280270.pdf; ComponentLink3URL: https://datasheet.ciiva.com/22685/27262-22685038.pdf; ComponentLink3Description: https://datasheet.ciiva.com/22685/27262-22685038.pdf; ComponentLink4URL: https://datasheet.ciiva.com/6691/f3115-6691487.pdf; ComponentLink4Description: https://datasheet.ciiva.com/6691/f3115-6691487.pdf; ComponentLink5URL: https://datasheet.ciiva.com/8512/f3115-8512543.pdf; ComponentLink5Description: https://datasheet.ciiva.com/8512/f3115-8512543.pdf; Supplier Part Number 1: 399-9598-1-ND
LINK1-LINK3 = QPC02SXGN-RC: CONN JUMPER SHORTING .100" GOLD; Manufacturer: Sullins; Number of Positions: 2; Pitch: 0.1inch; Supplier 1: Digi-Key; Manufacturer Part Number: QPC02SXGN-RC; Stock 1: 631791; Pricing 1: 1=0.1, 10=0.059, 25=0.044, 50=0.0378, 100=0.0365, 250=0.03152, 500=0.03024, 1000=0.02646, 2500=0.02394 (USD); Case/Package: 100; Contact Plating: Gold; Package Quantity: 2000; Packaging: Bulk; Height: 0.235inch; Lead Free: Lead Free; ComponentLink1URL: https://datasheet.ciiva.com/767/284-sxgn-11510-767869.pdf; ComponentLink1Description: https://datasheet.ciiva.com/767/284-sxgn-11510-767869.pdf; Supplier Part Number 1: S9337-ND
MH1-MH3 = MH_7.4MMC_3.2MMD: Mounting Hole 7.4mm Diameter, 3.2mm Drill
MH4 = MH_7.4MMNC_3.2MMD: Hole 7.4mm Diameter (Non Copper), 3.2mm Drill NPTH
R1 = RT0805FRE07100KL: RES SMD 100K OHM 1% 1/8W 0805; Manufacturer: Yageo; Resistance: 100kR; Power Rating: 125mW; Voltage Rating: 150V; Temperature Coefficient: 50ppm/°C; Supplier 1: Digi-Key; Manufacturer Part Number: RT0805FRE07100KL; Stock 1: 49182; Pricing 1: 1=0.11, 10=0.097, 100=0.0375, 1000=0.01648, 2500=0.01423 (USD); Case/Package: 0805; Case Code (Metric): 2012; Case Code (Imperial): 0805; Min Operating Temperature: -55°C; Max Operating Temperature: 125°C; Tolerance: 1%; Packaging: Tape and Reel; Package Quantity: 5000; Composition: Thin Film; Number of Terminations: 2; Termination: SMD/SMT; Military Standard: Not; Max Power Dissipation: 125mW; Voltage Rating (DC): 150V; Features: Moisture Resistant; Length: 0.079inch; Height: 0.024inch; Width: 0.049inch; Depth: 1.25mm; REACH SVHC: Unknown; Lead Free: Lead Free; ComponentLink1URL: https://datasheet.ciiva.com/2560/pyu-rt-1-to-0-05-rohs-l-5-2560882.pdf; ComponentLink1Description: https://datasheet.ciiva.com/2560/pyu-rt-1-to-0-05-rohs-l-5-2560882.pdf; ComponentLink2URL: https://datasheet.ciiva.com/7942/1392914-7942069.pdf; ComponentLink2Description: https://datasheet.ciiva.com/7942/1392914-7942069.pdf; ComponentLink3URL: https://datasheet.ciiva.com/12695/pyu-rt-1-to-0-05-rohs-l-4-12695301.pdf; ComponentLink3Description: https://datasheet.ciiva.com/12695/pyu-rt-1-to-0-05-rohs-l-4-12695301.pdf; Supplier Part Number 1: YAG3359CT-ND
R2 R3 R15 R17 R22 = RC0805FR-07560RL: RES SMD 560 OHM 1% 1/8W 0805; Manufacturer: Yageo; Temperature Coefficient: 100ppm/°C; Power Rating: 125mW; Voltage Rating: 150V; Supplier 1: Digi-Key; Manufacturer Part Number: RC0805FR-07560RL; Stock 1: 107034; Pricing 1: 1=0.1, 10=0.046, 100=0.0186, 1000=0.00835, 2500=0.00725 (USD); Case/Package: 0805; Weight: 0.000194oz; Case Code (Metric): 2012; Case Code (Imperial): 0805; Min Operating Temperature: -55°C; Max Operating Temperature: 155°C; Tolerance: 1%; Resistance: 560R; Packaging: Tape and Reel; Composition: Thick Film; Package Quantity: 1; Number of Terminations: 2; Termination: SMD/SMT; Military Standard: Not; Max Power Dissipation: 125mW; Features: Moisture Resistant; Length: 2mm; Height: 0.5mm; Width: 0.049inch; Depth: 1.25mm; REACH SVHC: Unknown; Lead Free: Lead Free; ComponentLink1URL: https://datasheet.ciiva.com/11808/0900766b8106beab-11808370.pdf; ComponentLink1Description: https://datasheet.ciiva.com/11808/0900766b8106beab-11808370.pdf; ComponentLink2URL: https://datasheet.ciiva.com/2457/pyu-r-int-thick-7-2457140.pdf; ComponentLink2Description: https://datasheet.ciiva.com/2457/pyu-r-int-thick-7-2457140.pdf; ComponentLink3URL: https://datasheet.ciiva.com/2457/pyu-r-int-thick-7-2457141.pdf; ComponentLink3Description: https://datasheet.ciiva.com/2457/pyu-r-int-thick-7-2457141.pdf; ComponentLink4URL: https://datasheet.ciiva.com/5561/rc0805-5561861.pdf; ComponentLink4Description: https://datasheet.ciiva.com/5561/rc0805-5561861.pdf; ComponentLink5URL: https://datasheet.ciiva.com/7941/444164-7941813.pdf; ComponentLink5Description: https://datasheet.ciiva.com/7941/444164-7941813.pdf; ComponentLink6URL: https://datasheet.ciiva.com/2457/pyu-r-int-thick-7-2457142.pdf; ComponentLink6Description: https://datasheet.ciiva.com/2457/pyu-r-int-thick-7-2457142.pdf; ComponentLink7URL: https://datasheet.ciiva.com/7941/444164-7941814.pdf; ComponentLink7Description: https://datasheet.ciiva.com/7941/444164-7941814.pdf; Supplier Part Number 1: 311-560CRCT-ND
R4 R14 R18-R21 = RC0805FR-0710KL: RES SMD 10K OHM 1% 1/8W 0805; Manufacturer: Yageo; Resistance: 10kR; Temperature Coefficient: 100ppm/°C; Power Rating: 125mW; Voltage Rating: 150V; Supplier 1: Digi-Key; Manufacturer Part Number: RC0805FR-0710KL; Stock 1: 0; Pricing 1: 1=0.1, 10=0.046, 100=0.0186, 1000=0.00835, 2500=0.00725 (USD); Case/Package: 0805; Case Code (Imperial): 0805; Case Code (Metric): 2012; Min Operating Temperature: -55°C; Max Operating Temperature: 155°C; Tolerance: 1%; Composition: Thick Film; Packaging: Tape and Reel; Package Quantity: 1; Termination: SMD/SMT; Number of Terminations: 2; Military Standard: Not; Max Power Dissipation: 125mW; Features: Moisture Resistant; Length: 2mm; Height: 0.024inch; Width: 0.049inch; Depth: 1.25mm; REACH SVHC: Unknown; Lead Free: Lead Free; ComponentLink1URL: https://datasheet.ciiva.com/11808/0900766b8106beab-11808151.pdf; ComponentLink1Description: https://datasheet.ciiva.com/11808/0900766b8106beab-11808151.pdf; ComponentLink2URL: https://datasheet.ciiva.com/12669/rc0805-12669688.pdf; ComponentLink2Description: https://datasheet.ciiva.com/12669/rc0805-12669688.pdf; ComponentLink3URL: https://datasheet.ciiva.com/46447/444164-46447563.pdf; ComponentLink3Description: https://datasheet.ciiva.com/46447/444164-46447563.pdf; ComponentLink4URL: https://datasheet.ciiva.com/2456/pyu-r-int-thick-7-2456972.pdf; ComponentLink4Description: https://datasheet.ciiva.com/2456/pyu-r-int-thick-7-2456972.pdf; ComponentLink5URL: https://datasheet.ciiva.com/2456/pyu-r-int-thick-7-2456973.pdf; ComponentLink5Description: https://datasheet.ciiva.com/2456/pyu-r-int-thick-7-2456973.pdf; ComponentLink6URL: https://datasheet.ciiva.com/2456/pyu-r-int-thick-7-2456974.pdf; ComponentLink6Description: https://datasheet.ciiva.com/2456/pyu-r-int-thick-7-2456974.pdf; ComponentLink7URL: https://datasheet.ciiva.com/16747/rc0805-16747087.pdf; ComponentLink7Description: https://datasheet.ciiva.com/16747/rc0805-16747087.pdf; Supplier Part Number 1: 311-10.0KCRCT-ND
R5-R7 R13 R23-R25 = RC0805FR-0722RL: RES SMD 22 OHM 1% 1/8W 0805; Manufacturer: Yageo; Temperature Coefficient: 100ppm/°C; Power Rating: 125mW; Voltage Rating: 150V; Supplier 1: Digi-Key; Manufacturer Part Number: RC0805FR-0722RL; Stock 1: 545224; Pricing 1: 1=0.1, 10=0.046, 100=0.0186, 1000=0.00835, 2500=0.00725 (USD); Case/Package: 0805; Case Code (Metric): 2012; Case Code (Imperial): 0805; Min Operating Temperature: -55°C; Max Operating Temperature: 155°C; Resistance: 22R; Tolerance: 1%; Composition: Thick Film; Packaging: Tape and Reel; Package Quantity: 1; Number of Terminations: 2; Termination: SMD/SMT; Military Standard: Not; Max Power Dissipation: 125mW; Working Voltage: 150V; Features: Moisture Resistant; Length: 0.079inch; Height: 0.024inch; Width: 0.049inch; Depth: 1.25mm; REACH SVHC: Unknown; Lead Free: Lead Free; ComponentLink1URL: https://datasheet.ciiva.com/2457/pyu-r-int-thick-7-2457044.pdf; ComponentLink1Description: https://datasheet.ciiva.com/2457/pyu-r-int-thick-7-2457044.pdf; ComponentLink2URL: https://datasheet.ciiva.com/2457/pyu-r-int-thick-7-2457045.pdf; ComponentLink2Description: https://datasheet.ciiva.com/2457/pyu-r-int-thick-7-2457045.pdf; ComponentLink3URL: https://datasheet.ciiva.com/2457/pyu-r-int-thick-7-2457046.pdf; ComponentLink3Description: https://datasheet.ciiva.com/2457/pyu-r-int-thick-7-2457046.pdf; ComponentLink4URL: https://datasheet.ciiva.com/46447/444164-46447574.pdf; ComponentLink4Description: https://datasheet.ciiva.com/46447/444164-46447574.pdf; ComponentLink5URL: https://datasheet.ciiva.com/16741/rc0805-16741465.pdf; ComponentLink5Description: https://datasheet.ciiva.com/16741/rc0805-16741465.pdf; ComponentLink6URL: https://datasheet.ciiva.com/12667/rc0805-12667371.pdf; ComponentLink6Description: https://datasheet.ciiva.com/12667/rc0805-12667371.pdf; ComponentLink7URL: https://datasheet.ciiva.com/11819/0900766b8106beab-11819837.pdf; ComponentLink7Description: https://datasheet.ciiva.com/11819/0900766b8106beab-11819837.pdf; Supplier Part Number 1: 311-22.0CRCT-ND
R8 R26-R28 = RC0805JR-070RL: YAGEO         RC0805JR-070RL             RES, THICK FILM, 0R, 0.125W, 0805; Resistance: 0mR; Tolerance: 5%; Power Rating: 125mW; Voltage Rating: 150V; Temperature Coefficient: 200ppm/°C; Supplier 1: Digi-Key; Manufacturer: Yageo; Manufacturer Part Number: RC0805JR-070RL; Stock 1: 3428942; Pricing 1: 1=0.1, 10=0.046, 25=0.0332, 50=0.0254, 100=0.0188, 250=0.01432, 500=0.01144, 1000=0.00842 (USD); Case/Package: 0805; Number of Pins: 2; Contact Plating: Tin,Matte; Case Code (Imperial): 0805; Case Code (Metric): 2012; Min Operating Temperature: -55°C; Max Operating Temperature: 155°C; Composition: Thick Film; Packaging: Tape and Reel; Voltage Rating (DC): 150V; Termination: SMD/SMT; Military Standard: Not; Length: 2mm; Height: 0.5mm; Width: 1.25mm; Depth: 1.25mm; Radiation Hardening: No; REACH SVHC: Unknown; Lead Free: Lead Free; ComponentLink1URL: https://datasheet.ciiva.com/7941/1738694-7941861.pdf; ComponentLink1Description: https://datasheet.ciiva.com/7941/1738694-7941861.pdf; ComponentLink2URL: https://datasheet.ciiva.com/7941/1738694-7941862.pdf; ComponentLink2Description: https://datasheet.ciiva.com/7941/1738694-7941862.pdf; ComponentLink3URL: https://datasheet.ciiva.com/11819/0900766b8106beab-11819430.pdf; ComponentLink3Description: https://datasheet.ciiva.com/11819/0900766b8106beab-11819430.pdf; ComponentLink4URL: https://datasheet.ciiva.com/7941/1738694-7941863.pdf; ComponentLink4Description: https://datasheet.ciiva.com/7941/1738694-7941863.pdf; ComponentLink5URL: https://datasheet.ciiva.com/15190/getdatasheetpartid-330685-15190028.pdf; ComponentLink5Description: https://datasheet.ciiva.com/15190/getdatasheetpartid-330685-15190028.pdf; Supplier Part Number 1: 311-0.0ARCT-ND
R9 R16 = RC0805FR-071ML: Yageo RC0805 Series Thick Film Surface Mount Resistor 0805 Case 1MO ±1% 0.125W ±100ppm/°C; Manufacturer: Yageo Phycomp; Resistance: 1MR; Power Rating: 125mW; Voltage Rating (DC): 150V; Supplier 1: Digi-Key; Manufacturer Part Number: RC0805FR-071ML; Stock 1: 0; Pricing 1: 1=0.1, 10=0.046, 100=0.0186, 1000=0.00835, 2500=0.00725 (USD); Mount: Surface Mount; Case/Package: 0805; Number of Pins: 2; Min Operating Temperature: -55°C; Max Operating Temperature: 155°C; Tolerance: 1%; Temperature Coefficient: 100ppm/°C; Packaging: Cut Tape; Length: 2mm; Height: 0.5mm; Width: 1.25mm; Depth: 1.25mm; REACH SVHC: No SVHC; Lead Free: Lead Free; ComponentLink1URL: http://www.mouser.com/ds/2/447/Yageo_08112016_RC0805-968729.pdf; ComponentLink1Description: http://www.mouser.com/ds/2/447/Yageo_08112016_RC0805-968729.pdf; ComponentLink2URL: http://www.farnell.com/datasheets/2167052.pdf; ComponentLink2Description: http://www.farnell.com/datasheets/2167052.pdf; ComponentLink3URL: http://www.yageo.com/documents/recent/PYu-RC_Group_51_RoHS_L_9.pdf; ComponentLink3Description: http://www.yageo.com/documents/recent/PYu-RC_Group_51_RoHS_L_9.pdf; Supplier Part Number 1: 311-1.00MCRCT-ND
R10-R12 = RC0805FR-071KL: RES SMD 1K OHM 1% 1/8W 0805; Manufacturer: Yageo; Resistance: 1kR; Temperature Coefficient: 100ppm/°C; Voltage Rating (DC): 150V; Power Rating: 125mW; Supplier 1: Digi-Key; Manufacturer Part Number: RC0805FR-071KL; Stock 1: 2117819; Pricing 1: 1=0.1, 10=0.046, 100=0.0186, 1000=0.00835, 2500=0.00725 (USD); Case/Package: 0805; Number of Pins: 2; Case Code (Metric): 2012; Case Code (Imperial): 0805; Min Operating Temperature: -55°C; Max Operating Temperature: 155°C; Tolerance: 1%; Packaging: Tape and Reel; Composition: Thick Film; Package Quantity: 1; Voltage Rating: 150V; Number of Terminations: 2; Termination: SMD/SMT; Military Standard: Not; Max Power Dissipation: 125mW; Features: Moisture Resistant; Length: 0.079inch; Height: 0.024inch; Width: 0.049inch; Depth: 1.25mm; REACH SVHC: Unknown; Lead Free: Lead Free; ComponentLink1URL: https://datasheet.ciiva.com/2456/pyu-r-int-thick-7-2456976.pdf; ComponentLink1Description: https://datasheet.ciiva.com/2456/pyu-r-int-thick-7-2456976.pdf; ComponentLink2URL: https://datasheet.ciiva.com/2456/pyu-r-int-thick-7-2456977.pdf; ComponentLink2Description: https://datasheet.ciiva.com/2456/pyu-r-int-thick-7-2456977.pdf; ComponentLink3URL: https://datasheet.ciiva.com/11819/0900766b8106beab-11819814.pdf; ComponentLink3Description: https://datasheet.ciiva.com/11819/0900766b8106beab-11819814.pdf; ComponentLink4URL: https://datasheet.ciiva.com/7941/1686128-7941719.pdf; ComponentLink4Description: https://datasheet.ciiva.com/7941/1686128-7941719.pdf; ComponentLink5URL: https://datasheet.ciiva.com/16850/rc0805-16850409.pdf; ComponentLink5Description: https://datasheet.ciiva.com/16850/rc0805-16850409.pdf; ComponentLink6URL: https://datasheet.ciiva.com/46385/444164-46385020.pdf; ComponentLink6Description: https://datasheet.ciiva.com/46385/444164-46385020.pdf; ComponentLink7URL: https://datasheet.ciiva.com/2456/pyu-r-int-thick-7-2456975.pdf; ComponentLink7Description: https://datasheet.ciiva.com/2456/pyu-r-int-thick-7-2456975.pdf; Supplier Part Number 1: 311-1.00KCRCT-ND
SCKT_FOR_U1 = 4828-3004-CP: SOCKET IC OPEN FRAME 28POS .3"; Manufacturer: 3M; Number of Contacts: 28; Gender: Female; Insulation Resistance: 5GR; Connector Type: DIP,Socket; Current Rating: 1A; Pitch: 2.54mm; Row Spacing: 7.62mm; Supplier 1: Digi-Key; Manufacturer Part Number: 4828-3004-CP; Stock 1: 14201; Pricing 1: 1=0.77, 10=0.673, 25=0.6336, 50=0.6072, 100=0.5808, 250=0.528, 500=0.4752, 1000=0.4224, 2500=0.3828 (USD); Mount: Through Hole; Contact Plating: Tin; Contact Material: Bronze; Housing Material: Glass; Min Operating Temperature: -25°C; Max Operating Temperature: 85°C; Number of Rows: 2; Termination: Solder; Orientation: Straight; Package Quantity: 5600; Number of Positions: 28; Length: 35.43mm; Width: 10.16mm; Depth: 5.08mm; REACH SVHC: Unknown; Lead Free: Lead Free; ComponentLink1URL: https://datasheet.ciiva.com/768/ts1099-768354.pdf; ComponentLink1Description: https://datasheet.ciiva.com/768/ts1099-768354.pdf; Supplier Part Number 1: 3M5480-ND
SW1 SW2 = 1825910-6: Switch Push Button OFF (ON) SPST Round Button 0.05A 24VDC Momentary Contact PC Pins Thru-Hole; Manufacturer: TE Connectivity Alcoswitch; Actuator Material: PBT; Mechanical Life: 100000Cycles; Operating Force: 160gf; Illumination Type: Non-Illuminated,Illuminated; Switch Travel: 0.25mm; Switch Function: Off-Mom; Max Voltage Rating (DC): 24V; Contact Current Rating: 50mA; Contact Resistance: 100mR; Actuator Length: 0.055inch; Supplier 1: Digi-Key; Manufacturer Part Number: 1825910-6; Stock 1: 32974; Pricing 1: 1=0.1, 10=0.091, 25=0.0876, 50=0.0844, 100=0.0798, 250=0.07508, 500=0.07196, 1000=0.05475, 5000=0.04536 (USD); Mount: Through Hole; Contact Material: Copper Alloy; Contact Plating: Silver; Min Operating Temperature: -35°C; Max Operating Temperature: 85°C; Throw Configuration: SPST; Packaging: Loose Piece; Termination: PC Pins; Package Quantity: 750; Orientation: Straight; Electrical Life: 100000Cycles; Type: Switch; Max Current Rating: 50mA; Length: 5.99mm; REACH SVHC: Unknown; ELV: Compliant; Lead Free: Lead Free; ComponentLink1URL: https://datasheet.ciiva.com/30199/1825910-6rqpn1825910-6-30199520.pdf; ComponentLink1Description: https://datasheet.ciiva.com/30199/1825910-6rqpn1825910-6-30199520.pdf; ComponentLink2URL: https://datasheet.ciiva.com/15184/getdatasheetpartid-395915-15184509.pdf; ComponentLink2Description: https://datasheet.ciiva.com/15184/getdatasheetpartid-395915-15184509.pdf; Supplier Part Number 1: 450-1650-ND